# EAGLE schematic radiosonde_lite (EAGLE 9.6.2)
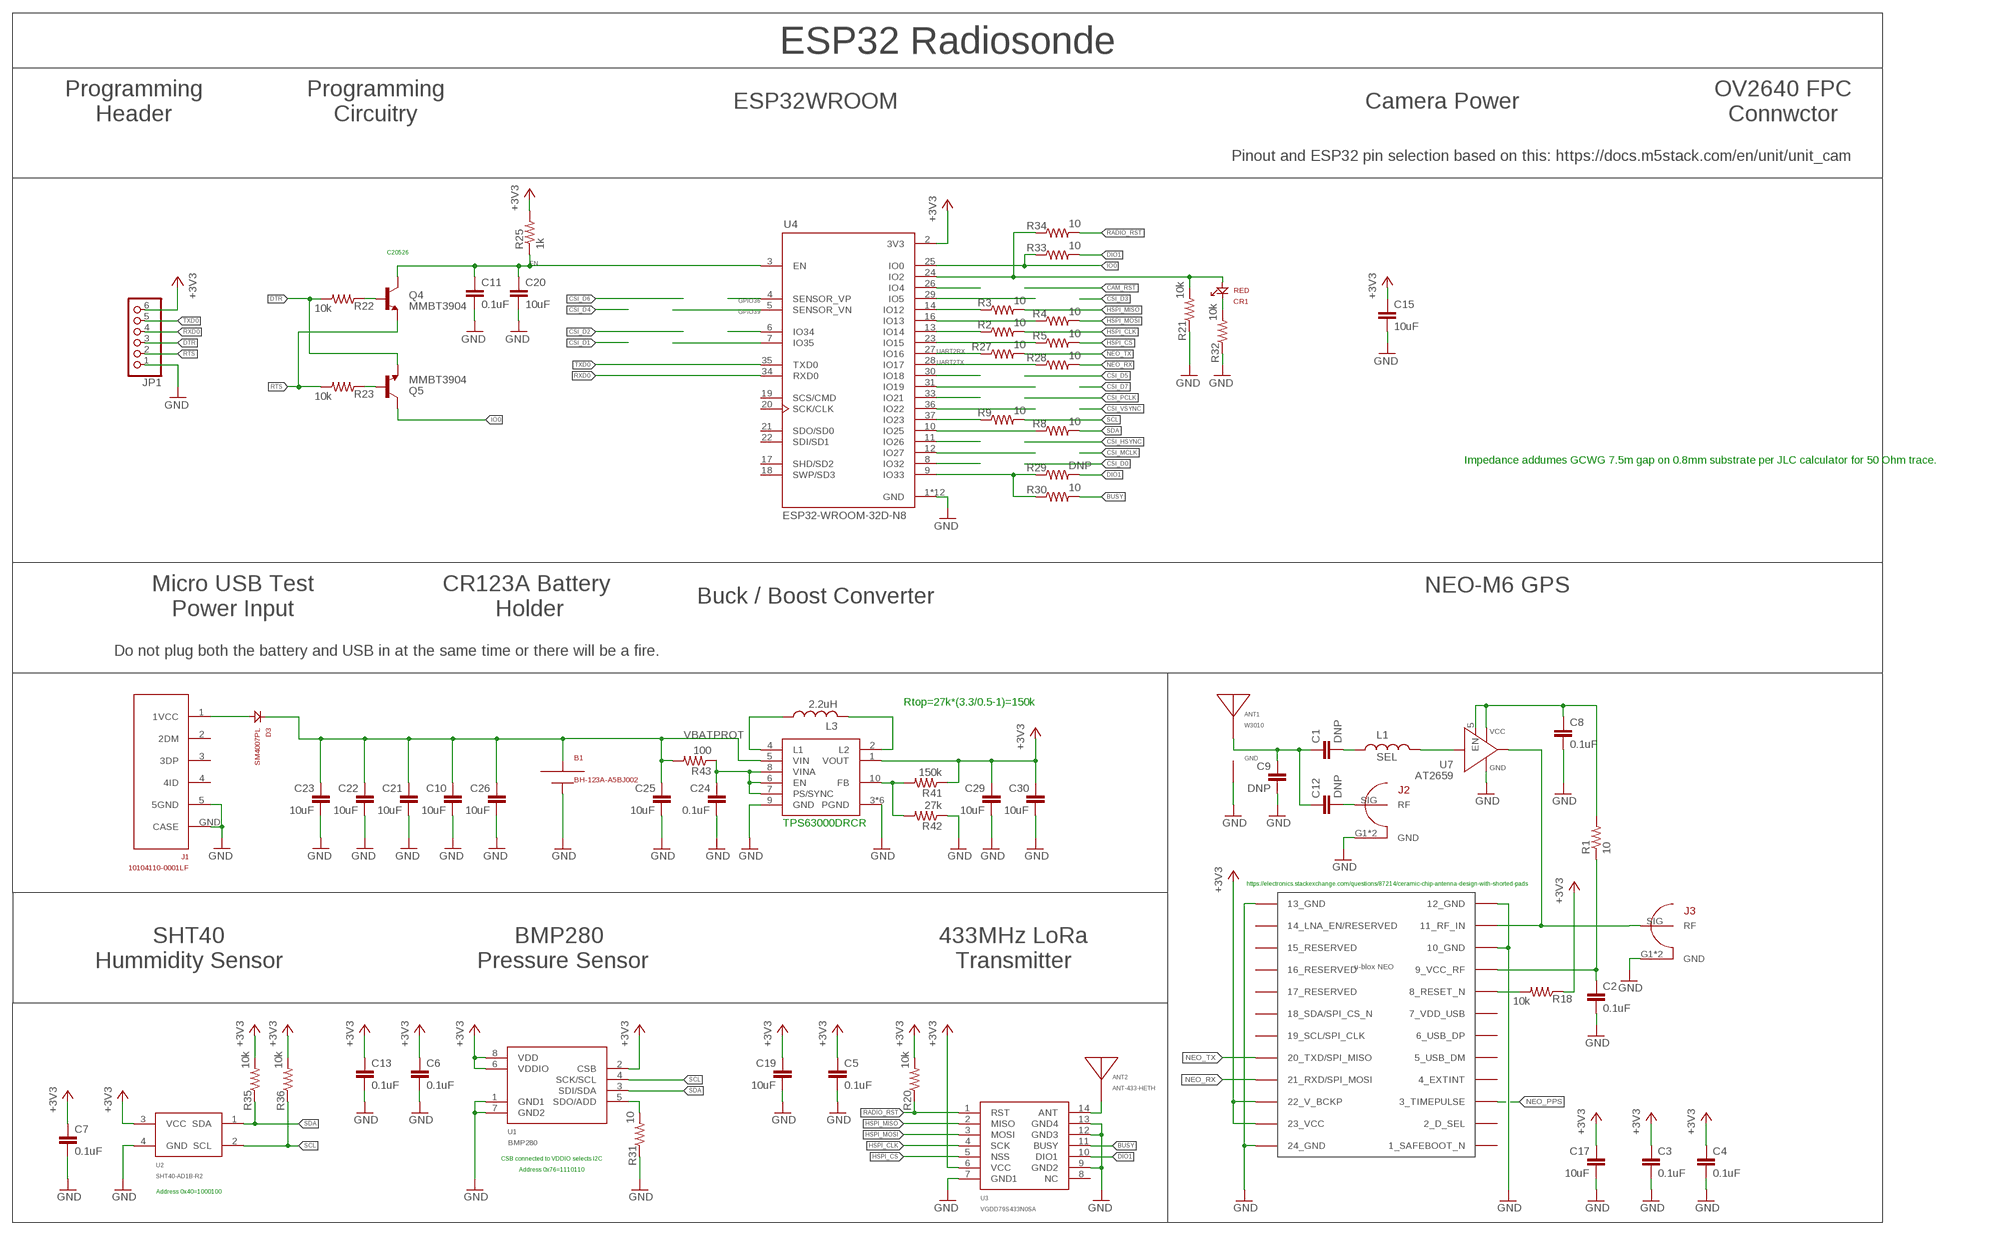
[diagram p0: schematic, sheet 1]

## Parts
ANT1  W3010  [W3010]
ANT2  ANT-433-HETH  [ANT-433-HETH]
B1  BH-123A-A5BJ002  [BH-123A-A5BJ002]
C1  DNP  0402_CAPACITOR  [0402_INDUCTOR]
C2  0.1uF  0402_CAPACITOR  [0402_INDUCTOR]
C3  0.1uF  0402_CAPACITOR  [0402_INDUCTOR]
C4  0.1uF  0402_CAPACITOR  [0402_INDUCTOR]
C5  0.1uF  0402_CAPACITOR  [0402_INDUCTOR]
C6  0.1uF  0402_CAPACITOR  [0402_INDUCTOR]
C7  0.1uF  0402_CAPACITOR  [0402_INDUCTOR]
C8  0.1uF  0402_CAPACITOR  [0402_INDUCTOR]
C9  DNP  0402_CAPACITOR  [0402_INDUCTOR]
C10  10uF  0603_CAPACITOR  [0603]
C11  0.1uF  0402_CAPACITOR  [0402_INDUCTOR]
C12  DNP  0402_CAPACITOR  [0402_INDUCTOR]
C13  0.1uF  0402_CAPACITOR  [0402_INDUCTOR]
C15  10uF  0603_CAPACITOR  [0603]
C17  10uF  0603_CAPACITOR  [0603]
C19  10uF  0603_CAPACITOR  [0603]
C20  10uF  0603_CAPACITOR  [0603]
C21  10uF  0603_CAPACITOR  [0603]
C22  10uF  0603_CAPACITOR  [0603]
C23  10uF  0603_CAPACITOR  [0603]
C24  0.1uF  0603_CAPACITOR  [0603]
C25  10uF  0603_CAPACITOR  [0603]
C26  10uF  0603_CAPACITOR  [0603]
C29  10uF  0603_CAPACITOR  [0603]
C30  10uF  0603_CAPACITOR  [0603]
CR1  RED  150060RS75000  [0603_DIODE]
D3  SM4007PL  [SOD123(AK)]
IC1  NEO-M8  [NEO-M8]
J1  10104110-0001LF  [MICRO_USB]
J2  CONUFL001-SMD  [U.FL]
J3  CONUFL001-SMD  [U.FL]
JP1  PINHD-1X6  [1X06]
L1  SEL  0402_INDUCTOR  [0402_INDUCTOR]
L3  2.2uH  CY43-2.2UH  [CY43]
Q4  MMBT3904  MMBT3904-TPCENTERED  [SOT23-3_CENTERED]
Q5  MMBT3904  MMBT3904-TPCENTERED  [SOT23-3_CENTERED]
R1  10  0402_RESISTOR  [R0402]
R2  10  0402_RESISTOR  [R0402]
R3  10  0402_RESISTOR  [R0402]
R4  10  0402_RESISTOR  [R0402]
R5  10  0402_RESISTOR  [R0402]
R8  10  0402_RESISTOR  [R0402]
R9  10  0402_RESISTOR  [R0402]
R18  10k  0402_RESISTOR  [R0402]
R20  10k  0402_RESISTOR  [R0402]
R21  10k  0402_RESISTOR  [R0402]
R22  10k  0402_RESISTOR  [R0402]
R23  10k  0402_RESISTOR  [R0402]
R25  1k  0603_RESISTOR  [0603]
R27  10  0402_RESISTOR  [R0402]
R28  10  0402_RESISTOR  [R0402]
R29  DNP  0402_RESISTOR  [R0402]
R30  10  0402_RESISTOR  [R0402]
R31  10  0402_RESISTOR  [R0402]
R32  10k  0402_RESISTOR  [R0402]
R33  10  0402_RESISTOR  [R0402]
R34  10  0402_RESISTOR  [R0402]
R35  10k  0402_RESISTOR  [R0402]
R36  10k  0402_RESISTOR  [R0402]
R41  150k  0603_RESISTOR  [0603]
R42  27k  0603_RESISTOR  [0603]
R43  100  0603_RESISTOR  [0603]
U1  BMP280  [BME280]
U2  SHT40-AD1B-R2  [SHT40]
U3  VGDD79S433N0SA  [VGDD79S433N0SA]
U4  ESP32-WROOM-32D-N8  ESP32-WROOM-32D  [MODULE_ESP32-WROOM-32D]
U6  TPS63000DRCR  [S-PVSON-N10]
U7  AT2659  [6DFN-1X1.6]

## Nets
+3V3: C3.P$1 C4.P$1 C5.P$1 C6.P$1 C7.P$1 C13.P$1 C15.1 C17.1 C19.1 C29.1 C30.1 IC1.22(22_V_BCKP) IC1.23(23_VCC) JP1.6 R18.1 R20.2 R25.2 R35.2 R36.2 R41.1 U1.2(CSB) U1.6(VDDIO) U1.8(VDD) U2.3(VCC) U3.6(VCC) U4.2(3V3) U6.1(VOUT)
BUSY: R30.2 U3.11(BUSY)
DIO1: R29.2 R33.2 U3.10(DIO1)
DTR: JP1.3 Q5.2(E) R22.2
EN: C11.P$1 C20.1 Q4.3(C) R25.1 U4.3(EN)
GND: ANT1.P$1(GND) ANT1.P$3(GND) B1.N(-) C2.P$2 C3.P$2 C4.P$2 C5.P$2 C6.P$2 C7.P$2 C8.P$2 C9.P$2 C10.2 C11.P$2 C13.P$2 C15.2 C17.2 C19.2 C20.2 C21.2 C22.2 C23.2 C24.2 C25.2 C26.2 C29.2 C30.2 IC1.10(10_GND) IC1.12(12_GND) IC1.13(13_GND) IC1.24(24_GND) J1.5(5GND) J1.GND(CASE) J2.G1(GND) J2.G2(GND) J3.G1(GND) J3.G2(GND) JP1.1 R21.1 R31.1 R32.1 R42.1 U1.1(GND1) U1.7(GND2) U2.4(GND) U3.7(GND1) U3.9(GND2) U3.12(GND3) U3.13(GND4) U4.1(GND) U4.15(GND) U4.38(GND) U4.39_1(GND) U4.39_2(GND) U4.39_3(GND) U4.39_4(GND) U4.39_5(GND) U4.39_6(GND) U4.39_7(GND) U4.39_8(GND) U4.39_9(GND) U6.3(PGND) U6.9(GND) U6.PG1(PGND) U6.PG2(PGND) U6.PG3(PGND) U6.PG4(PGND) U6.PG(PGND) U7.1(GND) U7.2(GND)
GPIO36: U4.4(SENSOR_VP)
GPIO39: U4.5(SENSOR_VN)
GPS_VCC_RF: C8.P$1 R1.2 U7.4(VS) U7.5(EN)
HSPI_CLK: R2.2 U3.4(SCK)
HSPI_CS: R5.2 U3.5(NSS)
HSPI_MISO: R3.2 U3.2(MISO)
HSPI_MOSI: R4.2 U3.3(MOSI)
IO0: Q5.3(C) R33.1 U4.25(IO0)
N$1: R3.1 U4.14(IO12)
N$2: IC1.8(8_RESET_N) R18.2
N$3: U4.26(IO4)
N$4: C1.P$2 L1.P$1
N$5: R29.1 R30.1 U4.9(IO33)
N$6: L1.P$2 U7.3(RF_IN)
N$7: U4.29(IO5)
N$9: R4.1 U4.16(IO13)
N$10: R31.2 U1.5(SDO/ADD)
N$11: ANT2.IN1 ANT2.IN2 U3.14(ANT)
N$12: U4.8(IO32)
N$13: R5.1 U4.23(IO15)
N$14: ANT1.P$2(ANT) C1.P$1 C9.P$1 C12.P$1
N$15: CR1.K R32.2
N$16: U4.30(IO18)
N$17: U4.31(IO19)
N$18: U4.33(IO21)
N$19: U4.36(IO22)
N$20: R9.1 U4.37(IO23)
N$21: R8.1 U4.10(IO25)
N$22: U4.11(IO26)
N$23: U4.12(IO27)
N$24: Q4.1(B) R22.1
N$25: D3.A J1.1(1VCC)
N$26: C2.P$1 IC1.9(9_VCC_RF) R1.1
N$27: Q5.1(B) R23.1
N$28: CR1.A R21.2 R34.1 U4.24(IO2)
N$29: R2.1 U4.13(IO14)
N$30: C12.P$2 J2.SIG(RF)
N$31: IC1.11(11_RF_IN) J3.SIG(RF) U7.6(RF_OUT)
N$36: U4.6(IO34)
N$37: U4.7(IO35)
N$44: L3.P$1 U6.4(L1)
N$47: L3.P$2 U6.2(L2)
N$48: R41.2 R42.2 U6.10(FB)
N$49: C24.1 R43.1 U6.6(EN) U6.7(PS/SYNC) U6.8(VINA)
NEO_PPS: IC1.3(3_TIMEPULSE)
NEO_RX: IC1.21(21_RXD/SPI_MOSI) R28.2
NEO_TX: IC1.20(20_TXD/SPI_MISO) R27.2
RADIO_RST: R20.1 R34.2 U3.1(RST)
RTS: JP1.2 Q4.2(E) R23.2
RXD0: JP1.4 U4.34(RXD0)
SCL: R9.2 R36.1 U1.4(SCK/SCL) U2.2(SCL)
SDA: R8.2 R35.1 U1.3(SDI/SDA) U2.1(SDA)
TXD0: JP1.5 U4.35(TXD0)
UART2RX: R27.1 U4.27(IO16)
UART2TX: R28.1 U4.28(IO17)
VBATPROT: B1.P(+) C10.1 C21.1 C22.1 C23.1 C25.1 C26.1 D3.K R43.2 U6.5(VIN)
Unconnected: IC1.1(1_SAFEBOOT_N) IC1.2(2_D_SEL) IC1.4(4_EXTINT) IC1.5(5_USB_DM) IC1.6(6_USB_DP) IC1.7(7_VDD_USB) IC1.14(14_LNA_EN/RESERVED) IC1.15(15_RESERVED) IC1.16(16_RESERVED) IC1.17(17_RESERVED) IC1.18(18_SDA/SPI_CS_N) IC1.19(19_SCL/SPI_CLK) J1.2(2DM) J1.3(3DP) J1.4(4ID) U3.8(NC) U4.17(SHD/SD2) U4.18(SWP/SD3) U4.19(SCS/CMD) U4.20(SCK/CLK) U4.21(SDO/SD0) U4.22(SDI/SD1)

## Notes on the sheet
- ESP32 Radiosonde
- Programming
  Header
- Programming
  Circuitry
- ESP32WROOM | Camera Power
- OV2640 FPC
  Connwctor
- Pinout and ESP32 pin selection based on this: https://docs.m5stack.com/en/unit/unit_cam
- C20526
- Impedance addumes GCWG 7.5m gap on 0.8mm substrate per JLC calculator for 50 Ohm trace.
- NEO-M6 GPS
- Micro USB Test
  Power Input
- CR123A Battery 
  Holder
- Buck / Boost Converter
- Do not plug both the battery and USB in at the same time or there will be a fire.
- Rtop=27k*(3.3/0.5-1)=150k
- TPS63000DRCR
- https://electronics.stackexchange.com/questions/87214/ceramic-chip-antenna-design-with-shorted-pads
- SHT40
  Hummidity Sensor
- BMP280 
  Pressure Sensor
- 433MHz LoRa
  Transmitter
- CSB connected to VDDIO selects I2C
- Address 0x76=1110110
- Address 0x40=1000100

## Library data of the parts
ANT1 = ruark2:W3010: 2.8dBi Chip antenna 1.575GHz - Antennas ROHS; JLCPCB: C6926293
ANT2 = ruark2:ANT-433-HETH: 433MHz Alarms, ISM, Remote Control, Security Systems Helical RF Antenna 418MHz ~ 458MHz 1.9dBi Solder Through Hole; PARTNO: ANT-433-HETH-ND
B1 = ruark2:BH-123A-A5BJ002: Battery case CR123A - Button And Strip Battery Connector ROHS; JLCPCB: C5290177
C1-C9 C11-C13 = ruark2:0402_CAPACITOR: 0402 select capacitor; VALUE: sel
C10 C15 C17 C19-C26 C29 C30 = ruark2:0603_CAPACITOR: 0603 Capacitor -- WARNING: NO DEFINED VALUE OR PART NUMBER; VALUE: sel
CR1 = ruark2:150060RS75000: Red 625nm LED Indication - Discrete 2V 0603 (1608 Metric); PARTNO: 732-4978-1-ND
D3 = ruark2:SM4007PL: 1A 1kV 1.1V@1A SOD-123FL Diodes - General Purpose ROHS JLCPCB: C64898
IC1 = ubloxLib:NEO-M8: u-blox NEO GNSS module
J1 = ruark2:10104110-0001LF: USB - micro B USB 2.0 Receptacle Connector 5 Position Surface Mount, Right Angle; PARTNO: 609-4052-1-ND
J2 J3 = ruark2:CONUFL001-SMD
JP1 = pinhead:PINHD-1X6: PIN HEADER
L1 = ruark2:0402_INDUCTOR: select
L3 = ruark2a:CY43-2.2UH: 2.3A 2.2uH ±20% 42mΩ SMD,4x4.5mm Inductors (SMD) ROHS; JLCPCB: C2929416
Q4 Q5 = ruark2a:MMBT3904-TP: Bipolar (BJT) Transistor NPN 40V 200mA 300MHz 350mW Surface Mount SOT-23 (SMD 2N3904)
R1-R5 R8 R9 R18 R20-R23 R27-R36 = ruark2:0402_RESISTOR: 0402 Resistor -- WARNING: NO DEFINED PART NUMBER OR VALUE
R25 R41-R43 = ruark2:0603_RESISTOR: 0603 Resistor -- WARNING: NO DEFINED PART NUMBER OR VALUE; VALUE: sel
U1 = ruark2:BMP280: Pressure Sensor 4.35PSI ~ 15.95PSI (30kPa ~ 110kPa) Absolute 16b 8-SMD; PARTNO: 828-1064-1-ND
U2 = ruark2:SHT40-AD1B-R2: Temperature and Humidity Sensor ROHS; JLCPCB: C2909890
U3 = ruark2:VGDD79S433N0SA: -118dBm 433MHz 22dBm SPI SMD,11.5x11.5mm LoRa Modules ROHS; JLCPCB: C2976576
U4 = ESP32-WROOM-32D:ESP32-WROOM-32D: Bluetooth, WiFi 802.11b/g/n, Bluetooth v4.2 + EDR, Class 1, 2 and 3 Transceiver Module 2.4GHz ~ 2.5GHz Integrated, Trace Surface Mount Check prices <https://pricing.snapeda.com/parts/ESP32-WROOM-32D/Espressif%20Systems/view-part?ref=eda>; AVAILABILITY: Bad; DESCRIPTION: Bluetooth, WiFi 802.11b/g/n, Bluetooth v4.2 +EDR, Class 1, 2 and 3 Transceiver Module 2.4GHz ~ 2.5GHz Integrated, Trace Surface Mount; MF: Espressif Systems; MP: ESP32-WROOM-32D; PACKAGE: Module Espressif Systems; PRICE: None
U6 = ruark2a:TPS63000DRCR: Buck-Boost Switching Regulator IC Positive Adjustable 1.2V 1 Output 1.6A (Switch) 10-VFDFN Exposed Pad; PARTNO: 296-19641-1-ND
U7 = ruark2:AT2659: 1.4V~3.6V 4.3mA DFN-6(1x1.6) Low Noise Amplifiers (LNA) - RF ROHS; JLCPCB: C92450

## Net classes
1 HV: clearance 0.406 mm